# EAGLE design Develop328 (EAGLE 7.6.0)
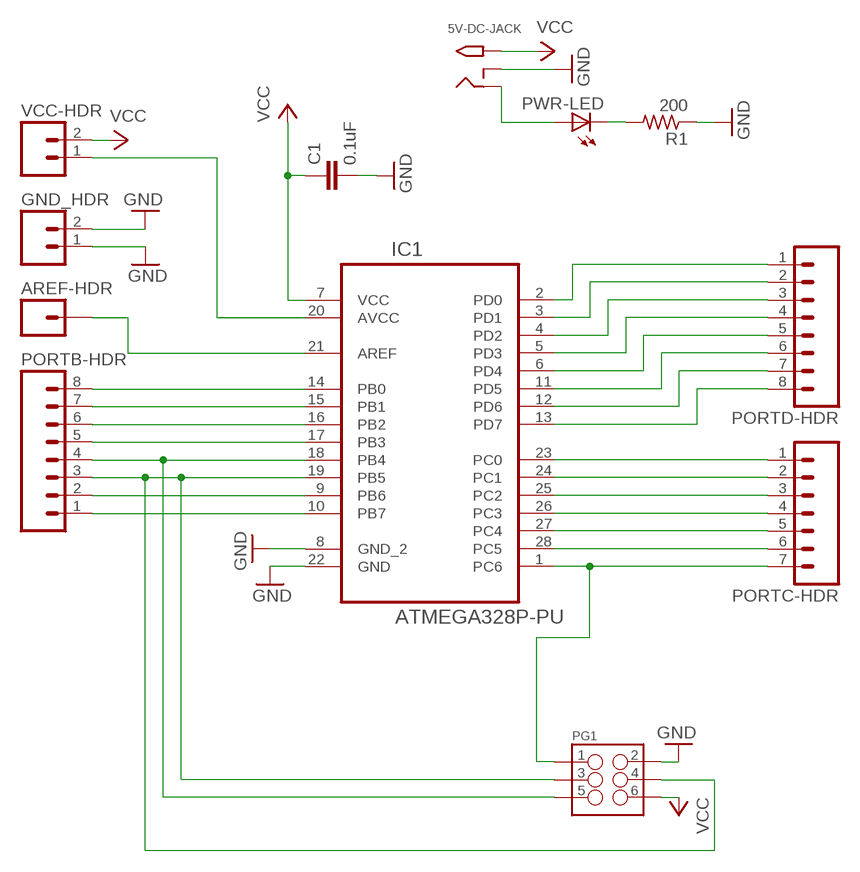
[diagram p0: schematic, sheet 1]

## Parts
5V-DC-JACK  2.1MMJACKTHM  [PJ-102A]
AREF-HDR  M01PTH  [1X01]
C1  0.1uF  0.1UF-50V-20%(PTH)KIT-EZ  [CAP-PTH-SMALL-KIT]
GND_HDR  M02PTH  [1X02]
IC1  ATMEGA328P-PU  [DIP254P762X457-28]
PG1  M03X2SHROUD  [2X3-SHROUDED]
PORTB-HDR  M08  [1X08_ROUND]
PORTC-HDR  M07  [1X07]
PORTD-HDR  M08  [1X08_ROUND]
PWR-LED  LED3MM  [LED3MM]
R1  200  R-US_0204/5  [0204/5]
VCC-HDR  M02PTH  [1X02]

## Nets
GND: 5V-DC-JACK.RING_SW C1.2 GND_HDR.1 GND_HDR.2 IC1.8(GND_2) IC1.22(GND) PG1.2 R1.1
N$1: IC1.14(PB0) PORTB-HDR.8
N$2: IC1.15(PB1) PORTB-HDR.7
N$3: IC1.16(PB2) PORTB-HDR.6
N$4: IC1.17(PB3) PORTB-HDR.5
N$5: IC1.18(PB4) PG1.5 PORTB-HDR.4
N$6: IC1.19(PB5) PG1.3 PG1.4 PORTB-HDR.3
N$7: IC1.9(PB6) PORTB-HDR.2
N$8: IC1.10(PB7) PORTB-HDR.1
N$9: IC1.23(PC0) PORTC-HDR.1
N$12: IC1.26(PC3) PORTC-HDR.4
N$13: IC1.27(PC4) PORTC-HDR.5
N$14: IC1.28(PC5) PORTC-HDR.6
N$15: IC1.1(PC6) PG1.1 PORTC-HDR.7
N$16: IC1.2(PD0) PORTD-HDR.1
N$17: IC1.3(PD1) PORTD-HDR.2
N$18: IC1.4(PD2) PORTD-HDR.3
N$19: IC1.5(PD3) PORTD-HDR.4
N$20: IC1.6(PD4) PORTD-HDR.5
N$21: IC1.11(PD5) PORTD-HDR.6
N$22: IC1.12(PD6) PORTD-HDR.7
N$23: IC1.13(PD7) PORTD-HDR.8
N$24: AREF-HDR.1 IC1.21(AREF)
N$25: IC1.20(AVCC) VCC-HDR.1
N$26: 5V-DC-JACK.RING PWR-LED.A
N$27: PWR-LED.K(C) R1.2
N$28: IC1.25(PC2) PORTC-HDR.3
N$29: IC1.24(PC1) PORTC-HDR.2
VCC: 5V-DC-JACK.TIP C1.1 IC1.7(VCC) PG1.6 VCC-HDR.2

## Library data of the parts
5V-DC-JACK = adafruit:2.1MMJACK: 2.1mm x 5.5mm THM DC jack with internal switch. Digikey part #PJ-102A, 4UCON part #05537 2.1mm x 5.5mm SMT DC jack with internal switch. Digikey part #PJ-002A-SMT, 4UCON part #03267 By microbuilder.eu & adafruit.com
AREF-HDR = SparkFun-Connectors:M01: Header 1 Standard 1-pin 0.1" header. Use with straight break away headers (SKU : PRT-00116), right angle break away headers (PRT-00553), swiss pins (PRT-00743), machine pins (PRT-00117), and female headers (PRT-00115). SMTSO-256-ET is a "flush mount" nut for a 4-40 screw. The older package used to be too tight, and did not allow it to sit properly thru the drill hit. The latest (0.165DIA) fits nice and snug.
C1 = SparkFun-Capacitors:0.1UF-50V-20%(PTH): CAP-08370; PROD_ID: CAP-08370
GND_HDR VCC-HDR = SparkFun-Connectors:M02: Standard 2-pin 0.1" header. Use with - straight break away headers ( PRT-00116) - right angle break away headers (PRT-00553) - swiss pins (PRT-00743) - machine pins (PRT-00117) - female headers (PRT-00115) Molex polarized connector foot print use with: PRT-08233 with associated crimp pins and housings. 2.54_SCREWTERM for use with PRT-10571. 3.5mm Screw Terminal footprints for PRT-08084 5mm Screw Terminal footprints for use with PRT-08432
IC1 = Atmel_By_element14_Batch_1-00:ATMEGA328P-PU: 8-bit Microcontroller with In-System Programmable Flash; MPN: ATMEGA328P-PU; OC_FARNELL: 1715487; OC_NEWARK: 15R0268; PACKAGE: PDIP-28; SUPPLIER: Atmel
PG1 = SparkFun-Connectors:M03X2: 2x3 .1" header. Shrouded, with keying- CONN-10681 SMT- CONN-11415 Pogo pins- HW-11044; PROD_ID: CONN-10681
PORTB-HDR PORTD-HDR = SparkFun-Connectors:M08: Header 8 Standard 8-pin 0.1" header. Use with straight break away headers (SKU : PRT-00116), right angle break away headers (PRT-00553), swiss pins (PRT-00743), machine pins (PRT-00117), and female headers (PRT-00115).; PROD_ID: CONN-08437
PORTC-HDR = SparkFun-Connectors:M07: Header 7 Standard 7-pin 0.1" header. Use with straight break away headers (SKU : PRT-00116), right angle break away headers (PRT-00553), swiss pins (PRT-00743), machine pins (PRT-00117), and female headers (PRT-00115). NOTES ON THE VARIANTS LOCK and LOCK_LONGPADS... This footprint was designed to help hold the alignment of a through-hole component (i.e. 7-pin header) while soldering it into place. You may notice that each hole has been shifted either up or down by 0.005 of an inch from it's more standard position (which is usually a perfectly straight line). This slight alteration caused the pins (the squares in the middle) to touch the edges of the holes. Because they are alternating, it causes a "brace" to hold the header in place. 0.005 has proven to be the perfect amount of "off-center" position when using our standard breakaway headers. Although looks a little odd when you look at the bare footprint, once you have a header in there, the alteration is very hard to notice. Also, if you push a header all the way into place, it is covered up entirely on the bottom side. This idea of altering the position of holes to aid alignment will be further integrated into the Sparkfun Library for other footprints. It can help hold any component with 3 or more connection pins.
PWR-LED = adafruit:LED: LED OSRAM: - CHIPLED LG R971, LG N971, LY N971, LG Q971, LY Q971, LO R971, LY R971 LH N974, LH R974 LS Q976, LO Q976, LY Q976 LO Q996 - Hyper CHIPLED LW Q18S LB Q993, LB Q99A, LB R99A - SideLED LS A670, LO A670, LY A670, LG A670, LP A670 LB A673, LV A673, LT A673, LW A673 LH A674 LY A675 LS A676, LA A676, LO A676, LY A676, LW A676 LS A679, LY A679, LG A679 - Hyper Micro SIDELED® LS Y876, LA Y876, LO Y876, LY Y876 LT Y87S - SmartLED LW L88C, LW L88S LB L89C, LB L89S, LG L890 LS L89K, LO L89K, LY L89K LS L896, LA L896, LO L896, LY L896 - TOPLED LS T670, LO T670, LY T670, LG T670, LP T670 LSG T670, LSP T670, LSY T670, LOP T670, LYG T670 LG T671, LOG T671, LSG T671 LB T673, LV T673, LT T673, LW T673 LH T674 LS T676, LA T676, LO T676, LY T676, LB T676, LH T676, LSB T676, LW T676 LB T67C, LV T67C, LT T67C, LS T67K, LO T67K, LY T67K, LW E67C LS E67B, LA E67B, LO E67B, LY E67B, LB E67C, LV E67C, LT E67C LW T67C LS T679, LY T679, LG T679 LS T770, LO T770, LY T770, LG T770, LP T770 LB T773, LV T773, LT T773, LW T773 LH T774 LS E675, LA E675, LY E675, LS T675 LS T776, LA T776, LO T776, LY T776, LB T776 LHGB T686 LT T68C, LB T68C - Hyper Mini TOPLED® LB M676 - Mini TOPLED Santana® LG M470 LS M47K, LO M47K, LY M47K Source: http://www.osram.convergy.de/
R1 = resistor:R-US_: RESISTOR, American symbol

## Net classes
0 default: width 0.305 mm, drill 0.508 mm, clearance 0.254 mm

## Board
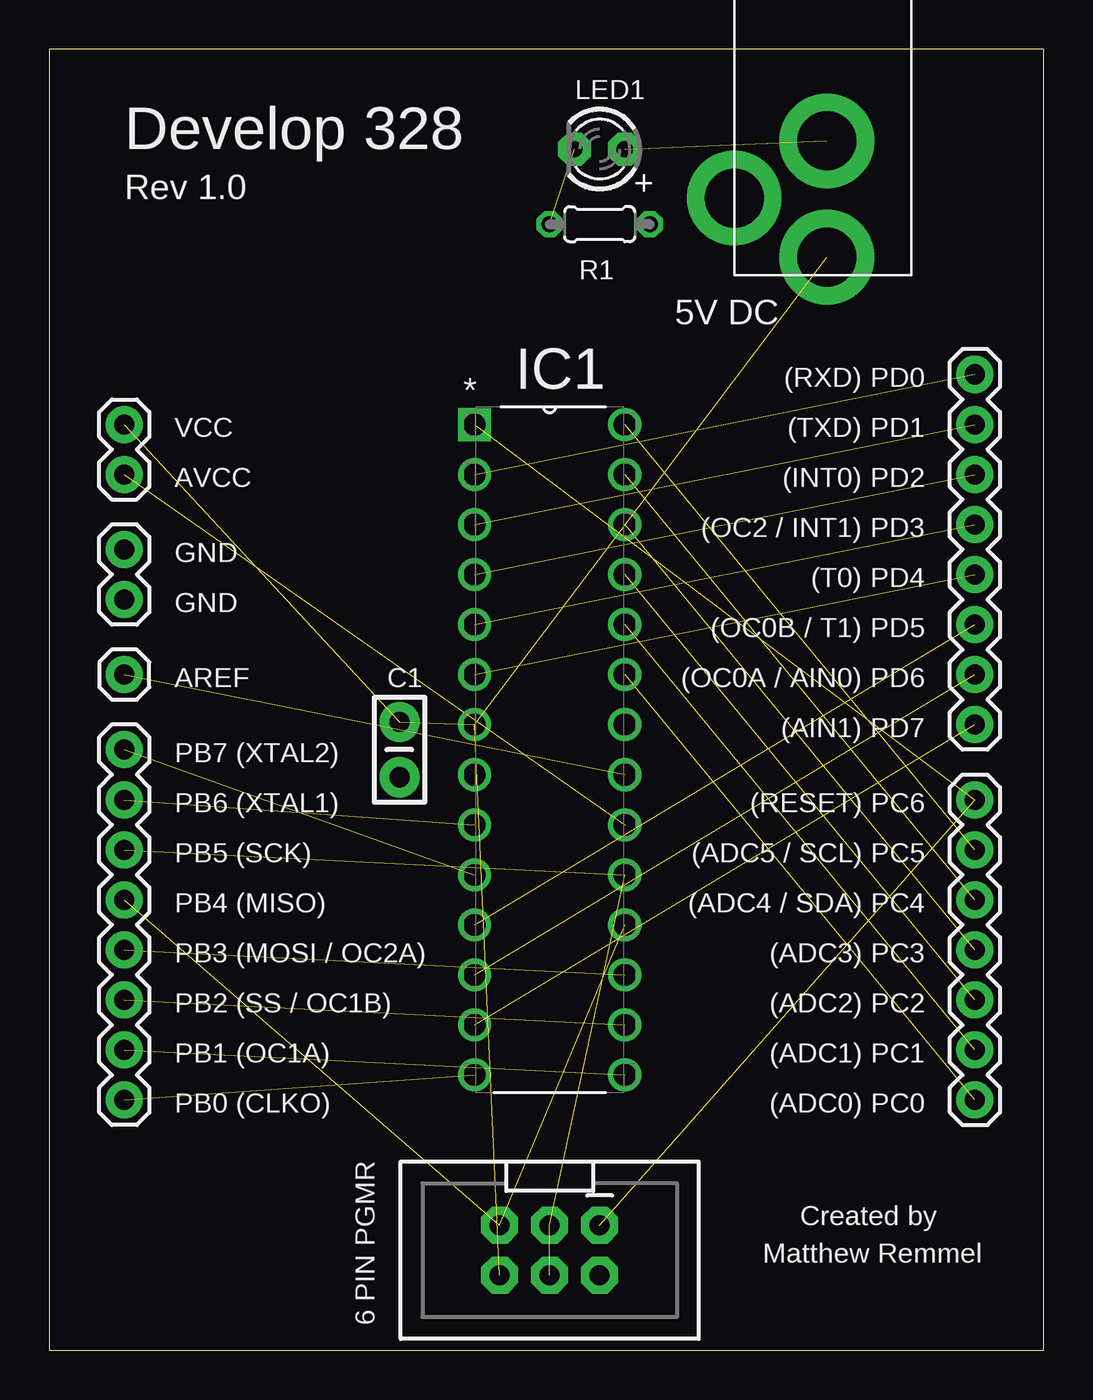
[diagram p1: board, top side]
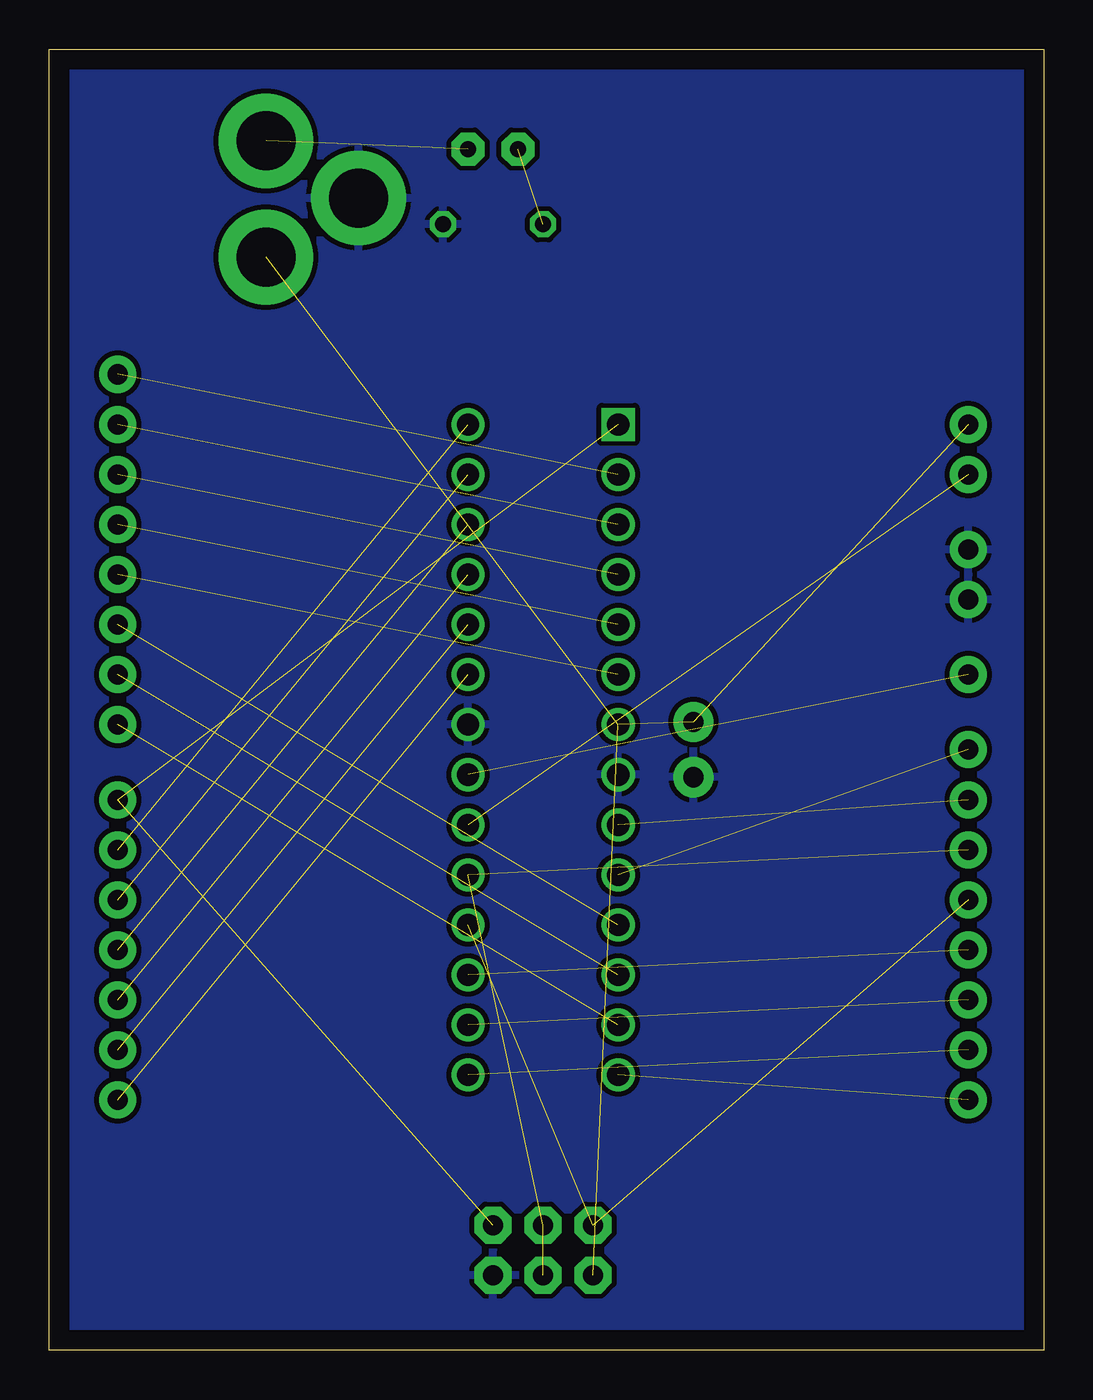
[diagram p2: board, bottom side, seen from below]

Size 50.47 x 66.03 mm. Coordinates in mm from the lower left corner, seen from the top.
Outline: 0,0 50.47,0 50.47,66.03 0,66.03 0,0
Copper layers (1*16): Top 0.035mm / dielectric 1.5mm / Bottom 0.035mm
Design rules "default": minimum track width 10mil, minimum drill 24mil, track to track 8mil, track to pad 8mil, pad to pad 8mil, via to via 8mil, smd to smd 8mil, copper to edge 40mil, drill to drill 8mil, minimum pad ring 10mil, minimum via ring 8mil, stop-mask expansion 4mil, vias tented up to drill 0mil, thermal gap 10mil

### Footprints (pad centres in the part's own frame; a part is rotated, then mirrored left to right if it is on the bottom)
PJ-102A = drill 3 pad 4.8: RING 0.1,-3.39; RING_SW -4.6,-6.29; TIP 0.1,-9.29
1X01 = drill 1.016 pad 1.88: 1 0,0
CAP-PTH-SMALL-KIT = drill 1.016 pad 2.032: 1 -1.397,0; 2 1.397,0
1X02 = drill 1.016 pad 1.88: 1 0,0; 2 2.54,0
DIP254P762X457-28 = drill 1.118 square: 1 -7.62,33.02 | drill 1.118: 2 -7.62,30.48; 3 -7.62,27.94; 4 -7.62,25.4; 5 -7.62,22.86; 6 -7.62,20.32; 7 -7.62,17.78; 8 -7.62,15.24; 9 -7.62,12.7; 10 -7.62,10.16; 11 -7.62,7.62; 12 -7.62,5.08; 13 -7.62,2.54; 14 -7.62,0; 15 0,0; 16 0,2.54; 17 0,5.08; 18 0,7.62; 19 0,10.16; 20 0,12.7; 21 0,15.24; 22 0,17.78; 23 0,20.32; 24 0,22.86; 25 0,25.4; 26 0,27.94; 27 0,30.48; 28 0,33.02
2X3-SHROUDED = drill 1.016 pad 1.88 octagon: 1 -1.27,2.54; 2 1.27,2.54; 3 -1.27,0; 4 1.27,0; 5 -1.27,-2.54; 6 1.27,-2.54
1X08_ROUND = drill 1.016 pad 1.88: 1 0,0; 2 2.54,0; 3 5.08,0; 4 7.62,0; 5 10.16,0; 6 12.7,0; 7 15.24,0; 8 17.78,0
1X07 = drill 1.016 pad 1.88: 1 0,0; 2 2.54,0; 3 5.08,0; 4 7.62,0; 5 10.16,0; 6 12.7,0; 7 15.24,0
LED3MM = drill 0.813 pad 1.676 octagon: A -1.27,0; K 1.27,0
0204/5 = drill 0.813 octagon: 1 -2.54,0; 2 2.54,0

### Placement (x,y rotation side)
5V-DC-JACK  39.37,64.77 0 top
AREF-HDR  3.81,34.29 0 top
C1  17.78,30.48 270 top
GND_HDR  3.81,40.64 270 top
IC1  29.21,13.97 0 top
PG1  25.4,5.08 270 top
PORTB-HDR  3.81,30.48 270 top
PORTC-HDR  46.99,12.7 90 top
PORTD-HDR  46.99,49.53 270 top
PWR-LED  27.94,60.96 180 top
R1  27.94,57.15 180 top
VCC-HDR  3.81,44.45 90 top

### Tracks (layer width: path | path; a pad name or v marks a point on that pad's centre or on a via)
GND
  pour Bottom: -2.54,67.31 -2.54,-1.27 49.53,-1.27 49.53,67.31
N$1  (1 unrouted)
N$2  (1 unrouted)
N$3  (1 unrouted)
N$4  (1 unrouted)
N$5  (2 unrouted)
N$6  (3 unrouted)
N$7  (1 unrouted)
N$8  (1 unrouted)
N$9  (1 unrouted)
N$12  (1 unrouted)
N$13  (1 unrouted)
N$14  (1 unrouted)
N$15  (2 unrouted)
N$16  (1 unrouted)
N$17  (1 unrouted)
N$18  (1 unrouted)
N$19  (1 unrouted)
N$20  (1 unrouted)
N$21  (1 unrouted)
N$22  (1 unrouted)
N$23  (1 unrouted)
N$24  (1 unrouted)
N$25  (1 unrouted)
N$26  (1 unrouted)
N$27  (1 unrouted)
N$28  (1 unrouted)
N$29  (1 unrouted)
VCC  (4 unrouted)

### Text on the board
tNames: LED1 | Develop 328 | Rev 1.0 | 5V DC | (RXD) PD0 | VCC | (TXD) PD1 | AVCC | (INT0) PD2 | (OC2 / INT1) PD3 | GND | (T0) PD4 | GND | (OC0B / T1) PD5 | AREF | C1 | (OC0A / AIN0) PD6 | (AIN1) PD7 | PB7 (XTAL2) | PB6 (XTAL1) | (RESET) PC6 | PB5 (SCK) | (ADC5 / SCL) PC5 | PB4 (MISO) | (ADC4 / SDA) PC4 | PB3 (MOSI / OC2A) | (ADC3) PC3 | PB2 (SS / OC1B) | (ADC2) PC2 | PB1 (OC1A) | (ADC1) PC1 | PB0 (CLKO) | (ADC0) PC0 | Created by | Matthew Remmel | 6 PIN PGMR